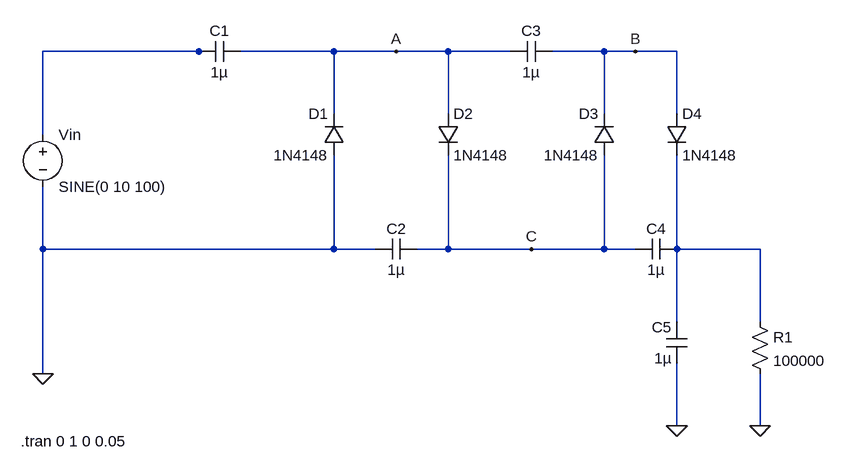
[diagram p0: schematic Draft9.asc]
Draft9.asc, the LTspice schematic file:
Version 4
SHEET 1 992 680
WIRE 16 48 -224 48
WIRE 32 48 16 48
WIRE 224 48 80 48
WIRE 320 48 224 48
WIRE 400 48 320 48
WIRE 496 48 400 48
WIRE 640 48 560 48
WIRE 688 48 640 48
WIRE 752 48 688 48
WIRE 224 144 224 48
WIRE 400 144 400 48
WIRE 640 144 640 48
WIRE 752 144 752 48
WIRE -224 176 -224 48
WIRE -224 352 -224 256
WIRE 224 352 224 208
WIRE 224 352 -224 352
WIRE 288 352 224 352
WIRE 400 352 400 208
WIRE 400 352 352 352
WIRE 528 352 400 352
WIRE 640 352 640 208
WIRE 640 352 528 352
WIRE 688 352 640 352
WIRE 752 352 752 208
WIRE 880 352 752 352
WIRE 752 464 752 352
WIRE 880 464 880 352
WIRE -224 544 -224 352
WIRE 752 624 752 528
WIRE 880 624 880 544
FLAG 752 624 0
FLAG 880 624 0
FLAG -224 544 0
FLAG 320 48 A
FLAG 688 48 B
FLAG 528 352 C
SYMBOL diode 240 208 R180
WINDOW 0 24 64 Left 2
WINDOW 3 24 0 Left 2
SYMATTR InstName D1
SYMATTR Value 1N4148
SYMBOL diode 384 144 R0
SYMATTR InstName D2
SYMATTR Value 1N4148
SYMBOL diode 656 208 R180
WINDOW 0 24 64 Left 2
WINDOW 3 24 0 Left 2
SYMATTR InstName D3
SYMATTR Value 1N4148
SYMBOL diode 736 144 R0
SYMATTR InstName D4
SYMATTR Value 1N4148
SYMBOL cap 80 32 R90
WINDOW 0 0 32 VBottom 2
WINDOW 3 32 32 VTop 2
SYMATTR InstName C1
SYMATTR Value 1µ
SYMBOL cap 352 336 R90
WINDOW 0 0 32 VBottom 2
WINDOW 3 32 32 VTop 2
SYMATTR InstName C2
SYMATTR Value 1µ
SYMBOL cap 560 32 R90
WINDOW 0 0 32 VBottom 2
WINDOW 3 32 32 VTop 2
SYMATTR InstName C3
SYMATTR Value 1µ
SYMBOL cap 752 336 R90
WINDOW 0 0 32 VBottom 2
WINDOW 3 32 32 VTop 2
SYMATTR InstName C4
SYMATTR Value 1µ
SYMBOL res 864 448 R0
SYMATTR InstName R1
SYMATTR Value 100000
SYMBOL cap 768 528 R180
WINDOW 0 24 56 Left 2
WINDOW 3 24 8 Left 2
SYMATTR InstName C5
SYMATTR Value 1µ
SYMBOL voltage -224 160 R0
WINDOW 123 0 0 Left 0
WINDOW 39 0 0 Left 0
SYMATTR InstName Vin
SYMATTR Value SINE(0 10 100)
TEXT -258 648 Left 2 !.tran 0 1 0 0.05

The netlist it stands for:
* Draft9.asc
D1 0 A 1N4148
D2 A C 1N4148
D3 C B 1N4148
D4 B N002 1N4148
C1 A N001 1µ
C2 C 0 1µ
C3 B A 1µ
C4 N002 C 1µ
R1 N002 0 100000
C5 0 N002 1µ
Vin N001 0 SINE(0 10 100)
.model D D
.lib standard.dio
.tran 0 1 0 0.05
.backanno
.end